# Altium schematic sheet Iluminacao.SchDoc
size A4; SheetNumber: 5; SheetTotal: 5
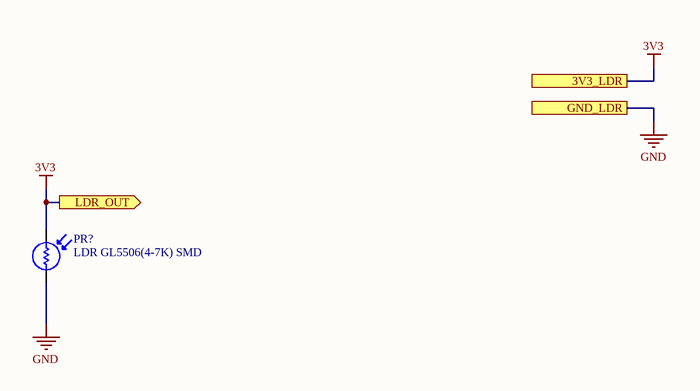
[diagram p0: Iluminacao.SchDoc]

## Parts
PR?  LDR GL5506(4-7K) SMD  [LDR 3x0.5]

## Ports
3V3_LDR, GND_LDR, LDR_OUT (out)

## Nets
3V3: PR?.1 ; port 3V3_LDR, port LDR_OUT
GND: PR?.2 ; port GND_LDR

## Library data of the parts
PR? = CMP-017-000003-1: THROUGH HOLE PHOTORESISTORS ROHS; Manufacturer 1: JCHL(Shenzhen Jing Chuang He Li Tech); Manufacturer Part Number 1: GL5506(4-7K); Design Item ID: LDR GL5506(4-7K) SMD; Source: mits.SchLib